# EAGLE design Rapiguard (EAGLE 8.6.0)
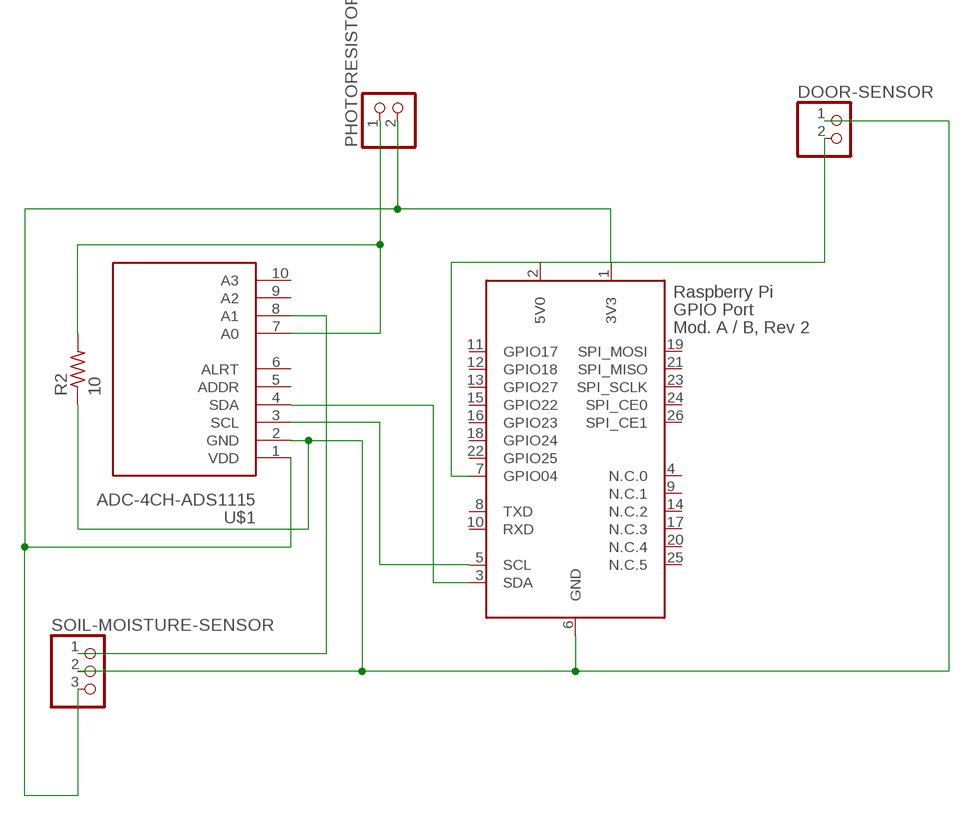
[diagram p0: schematic, sheet 1]

## Parts
DOOR-SENSOR  PINHD-1X2  [1X02]
PHOTORESISTOR  PINHD-1X2  [1X02]
R2  10  R-US_0204/7  [0204/7]
SOIL-MOISTURE-SENSOR  PINHD-1X3  [1X03]
U$1  ADC-4CH-ADS1115  [ADC-4CH-ADS1115]
X2  RASPI_BOARD_B-_E0  [RASPI_BOARD_B-_EDGES_0DRILL]

## Nets
A0: PHOTORESISTOR.1 R2.2 U$1.7(A0)
A1: SOIL-MOISTURE-SENSOR.1 U$1.8(A1)
GND: DOOR-SENSOR.1 R2.1 SOIL-MOISTURE-SENSOR.2 U$1.2(GND) X2.6(GND)
GPIO04: DOOR-SENSOR.2 X2.7(GPIO04)
SCL: U$1.3(SCL) X2.5(SCL)
SDA: U$1.4(SDA) X2.3(SDA)
VDD: PHOTORESISTOR.2 SOIL-MOISTURE-SENSOR.3 U$1.1(VDD) X2.1(3V3)
Unconnected: U$1.5(ADDR) U$1.6(ALRT) U$1.9(A2) U$1.10(A3) X2.4(N.C.0) X2.8(TXD) X2.9(N.C.1) X2.10(RXD) X2.11(GPIO17) X2.12(GPIO18) X2.13(GPIO27) X2.14(N.C.2) X2.15(GPIO22) X2.16(GPIO23) X2.17(N.C.3) X2.18(GPIO24) X2.19(SPI_MOSI) X2.20(N.C.4) X2.21(SPI_MISO) X2.22(GPIO25) X2.23(SPI_SCLK) X2.24(SPI_CE0) X2.25(N.C.5) X2.26(SPI_CE1)

## Power pins joined to a net without a drawn wire
5V0: X2.2(5V0)

## Library data of the parts
DOOR-SENSOR PHOTORESISTOR = pinhead:PINHD-1X2: PIN HEADER
R2 = resistor:R-US_: RESISTOR, American symbol
SOIL-MOISTURE-SENSOR = pinhead:PINHD-1X3: PIN HEADER
U$1 = diy-modules:ADC-4CH-ADS1115: 4 Channel 16-Bit Analog-to-Digital Converter based on ADS1115 chip Arduino ADS1115 Getting Started Tutorial is available here: http://henrysbench.capnfatz.com/henrys-bench/arduino-voltage-measurements/arduino-ads1115-module-getting-started-tutorial/ ADS1115 datasheet is available here: http://www.ti.com/lit/ds/symlink/ads1115.pdf Click here to find device on ebay.com <http://www.ebay.com/sch/ads1115+module>
X2 = raspberrypi_bastelstube_v13:RASPI_BOARD_B-: Raspberry Pi GPIO connector with markings for the outer dimensions of the Raspberry Pi board model B+ GPIO connector reduced to 26 pins to match models A and B with different sets of drill holes or mounting pads

## Module DOOR_SENSOR
Ports: 

### Library data of the parts

## Board
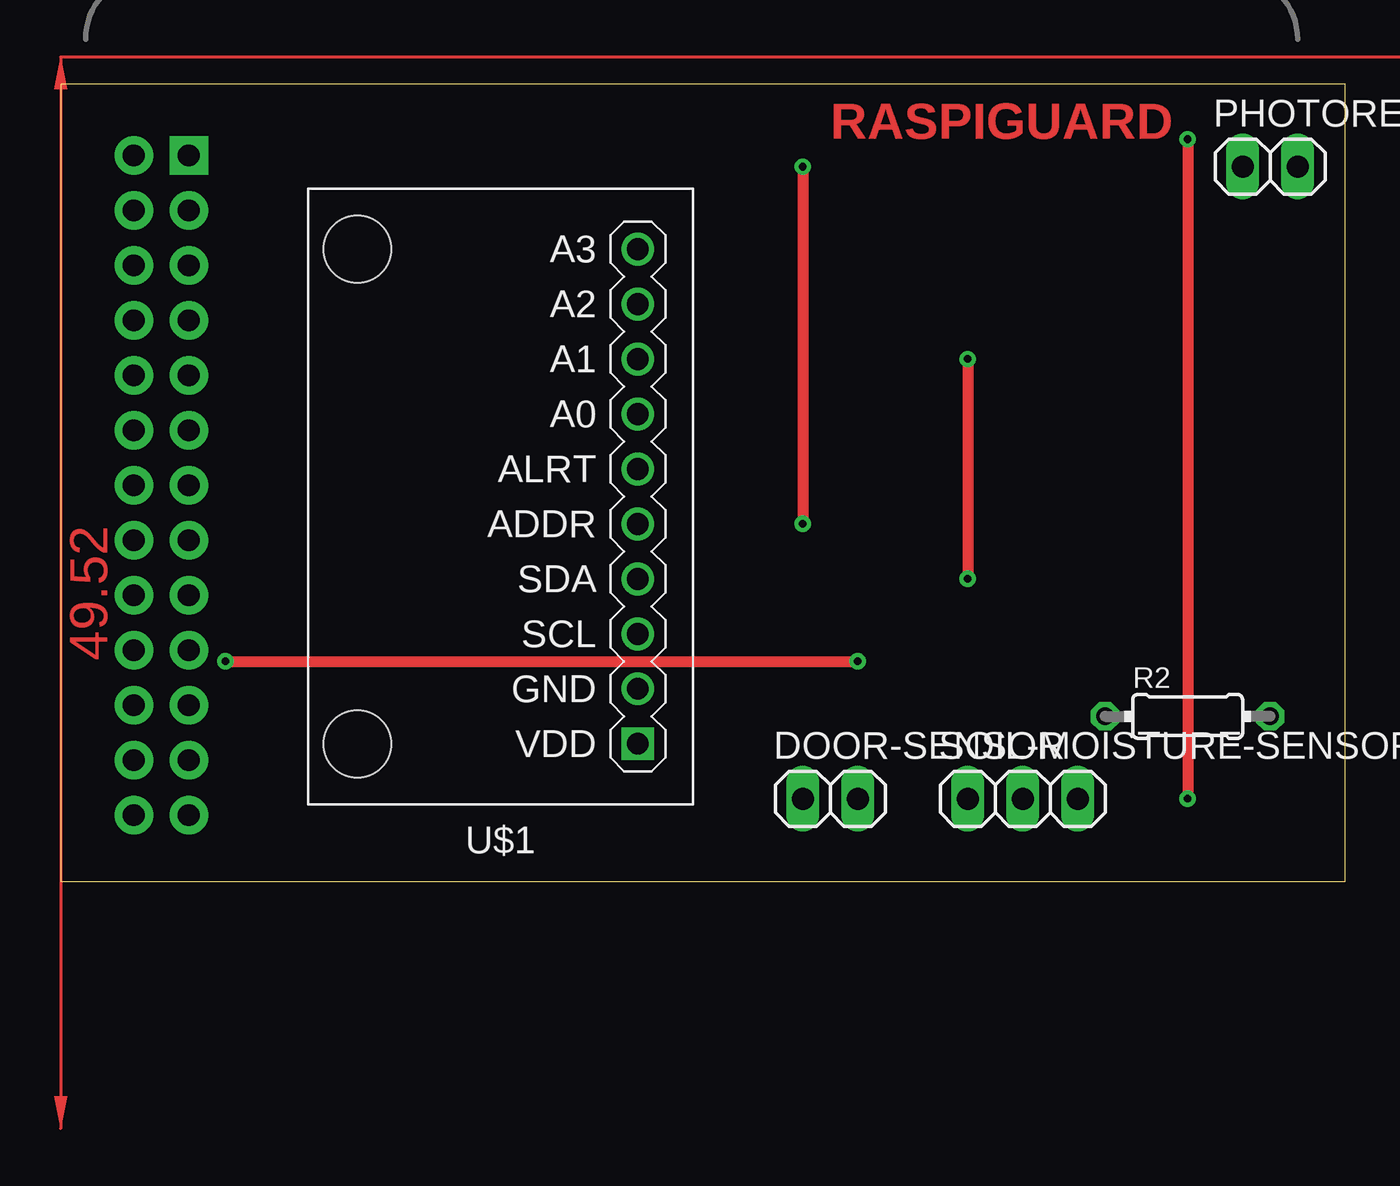
[diagram p1: board, top side]
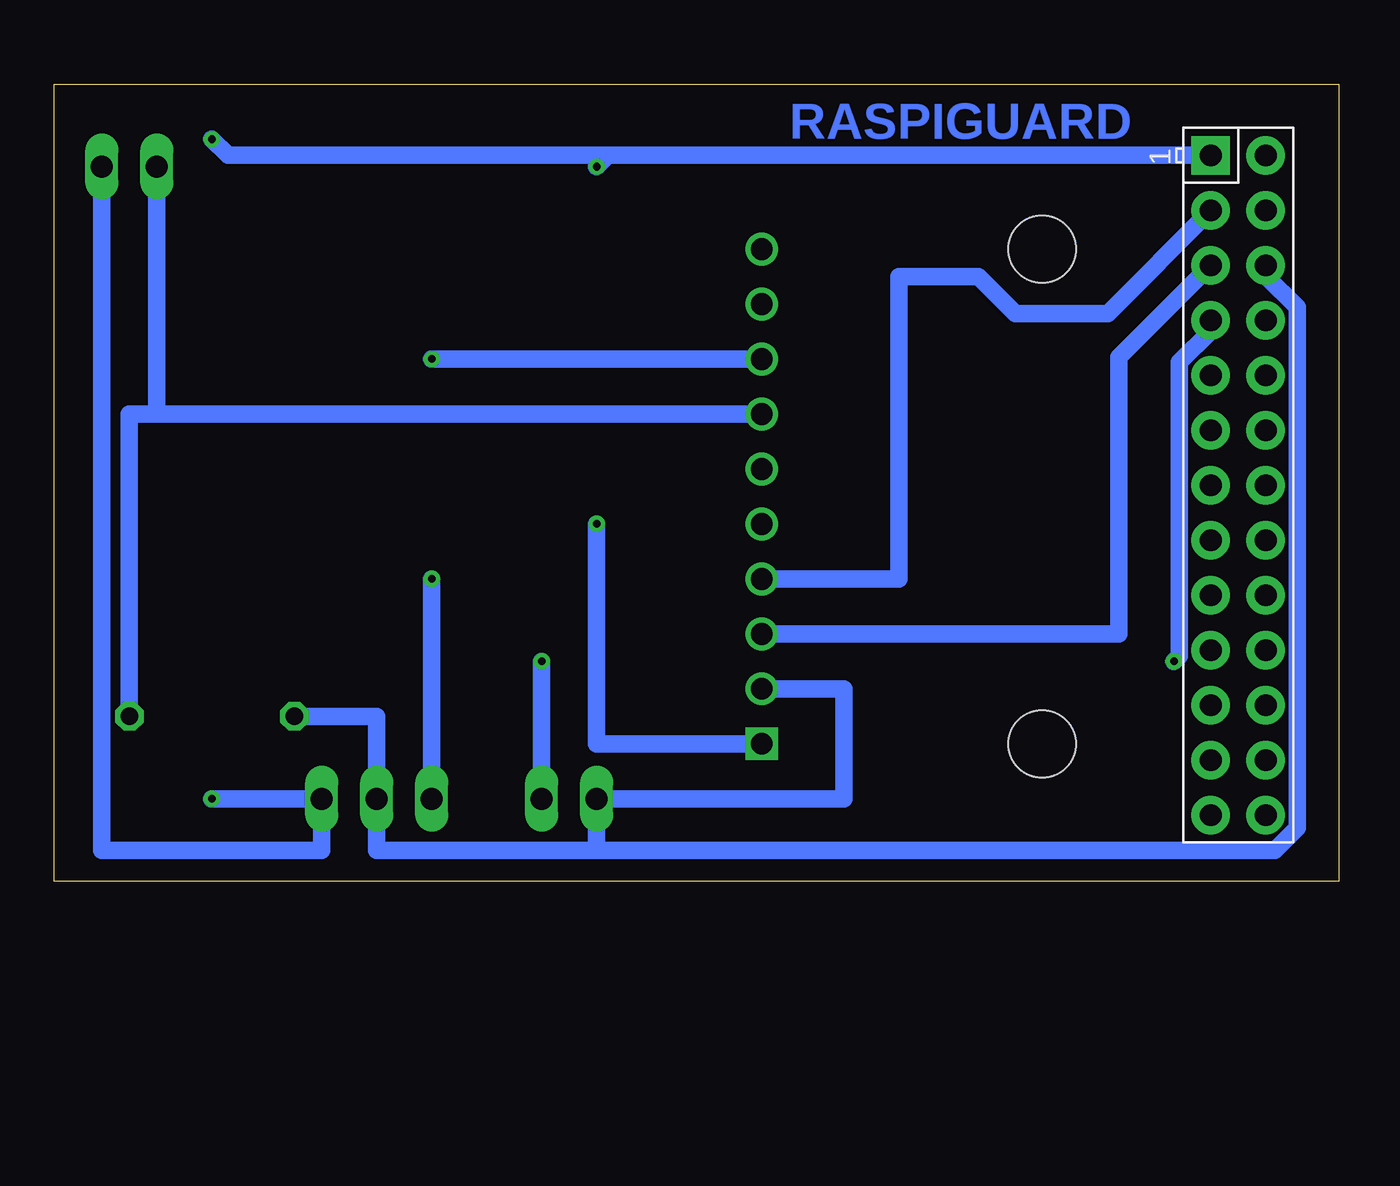
[diagram p2: board, bottom side, seen from below]

Size 59.36 x 36.82 mm. Coordinates in mm from the lower left corner, seen from the top.
Outline: 0,0 59.36,0 59.36,36.82 0,36.82 0,0
Copper layers (1*16): Top 0.035mm / dielectric 1.5mm / Bottom 0.035mm
Design rules "default *": minimum track width 16mil, minimum drill 0.35mm, track to track 6mil, track to pad 6mil, pad to pad 6mil, via to via 6mil, smd to smd 6mil, copper to edge 40mil, drill to drill 6mil, minimum pad ring 10mil, minimum via ring 8mil, stop-mask expansion 4mil, vias tented up to drill 0mil, thermal gap 10mil

### Footprints (pad centres in the part's own frame; a part is rotated, then mirrored left to right if it is on the bottom)
1X02 = drill 1.016 long: 1 -1.27,0; 2 1.27,0
0204/7 = drill 0.813 octagon: 1 -3.81,0; 2 3.81,0
1X03 = drill 1.016 long: 1 -2.54,0; 2 0,0; 3 2.54,0
ADC-4CH-ADS1115 = drill 1 square: 1 -6.35,11.43 | drill 1: 2 -6.35,8.89; 3 -6.35,6.35; 4 -6.35,3.81; 5 -6.35,1.27; 6 -6.35,-1.27; 7 -6.35,-3.81; 8 -6.35,-6.35; 9 -6.35,-8.89; 10 -6.35,-11.43 | hole 3.1: 6.604,11.43; 6.604,-11.43
RASPI_BOARD_B-_EDGES_0DRILL = drill 1 pad 1.778 square: 1 8.37,51.23 | drill 1 pad 1.778: 2 8.37,53.77; 3 10.91,51.23; 4 10.91,53.77; 5 13.45,51.23; 6 13.45,53.77; 7 15.99,51.23; 8 15.99,53.77; 9 18.53,51.23; 10 18.53,53.77; 11 21.07,51.23; 12 21.07,53.77; 13 23.61,51.23; 14 23.61,53.77; 15 26.15,51.23; 16 26.15,53.77; 17 28.69,51.23; 18 28.69,53.77; 19 31.23,51.23; 20 31.23,53.77; 21 33.77,51.23; 22 33.77,53.77; 23 36.31,51.23; 24 36.31,53.77; 25 38.85,51.23; 26 38.85,53.77

### Placement (x,y rotation side)
DOOR-SENSOR  35.56,3.81 0 top
PHOTORESISTOR  55.88,33.02 0 top
R2  52.07,7.62 0 top
SOIL-MOISTURE-SENSOR  44.45,3.81 0 top
U$1  20.32,17.78 180 top
X2  57.15,41.91 270 bottom

### Tracks (layer width: path | path; a pad name or v marks a point on that pad's centre or on a via)
A0
  Bottom 0.813: U$1.7 54.61,21.59 | 54.61,21.59 55.88,21.59 R2.2 | PHOTORESISTOR.1 54.61,21.59
A1  (via drill 0.35)
  Top 0.508: v41.91,24.13 v41.91,13.97
  Bottom 0.813: U$1.8 v41.91,24.13 | v41.91,13.97 SOIL-MOISTURE-SENSOR.1
GND
  Bottom 0.813: 34.29,1.42 44.45,1.42 SOIL-MOISTURE-SENSOR.2 44.45,7.62 R2.1 | 34.29,1.42 DOOR-SENSOR.1 22.86,3.81 22.86,8.89 U$1.2 | X2.6 3.38,27.97 1.93,26.52 1.93,2.46 2.97,1.42 34.29,1.42
GPIO04  (via drill 0.35)
  Top 0.508: v7.62,10.16 v36.83,10.16
  Bottom 0.813: v7.62,10.16 7.37,10.41 7.37,23.98 5.92,25.43 X2.7 | v36.83,10.16 DOOR-SENSOR.2
SCL
  Bottom 0.813: X2.5 10.16,24.22 10.16,11.43 U$1.3
SDA
  Bottom 0.813: X2.3 10.68,26.24 14.95,26.24 16.65,27.94 20.32,27.94 20.32,13.97 U$1.4
VDD  (via drill 0.35)
  Top 0.508: v34.29,33.02 v34.29,16.51 | v52.07,34.29 v52.07,3.81
  Bottom 0.813: X2.1 33.77,33.54 | 33.77,33.54 v34.29,33.02 | v34.29,16.51 34.29,6.35 U$1.1 | 33.77,33.54 51.32,33.54 v52.07,34.29 | v52.07,3.81 SOIL-MOISTURE-SENSOR.3 46.99,1.42 57.15,1.42 PHOTORESISTOR.2
(copper drawn outside any net)
  shapes: Top area x2

### Text on the board
Top: RASPIGUARD
Bottom: RASPIGUARD